# EAGLE design Módulo U.V. v.1.0 (EAGLE 9.4.2)
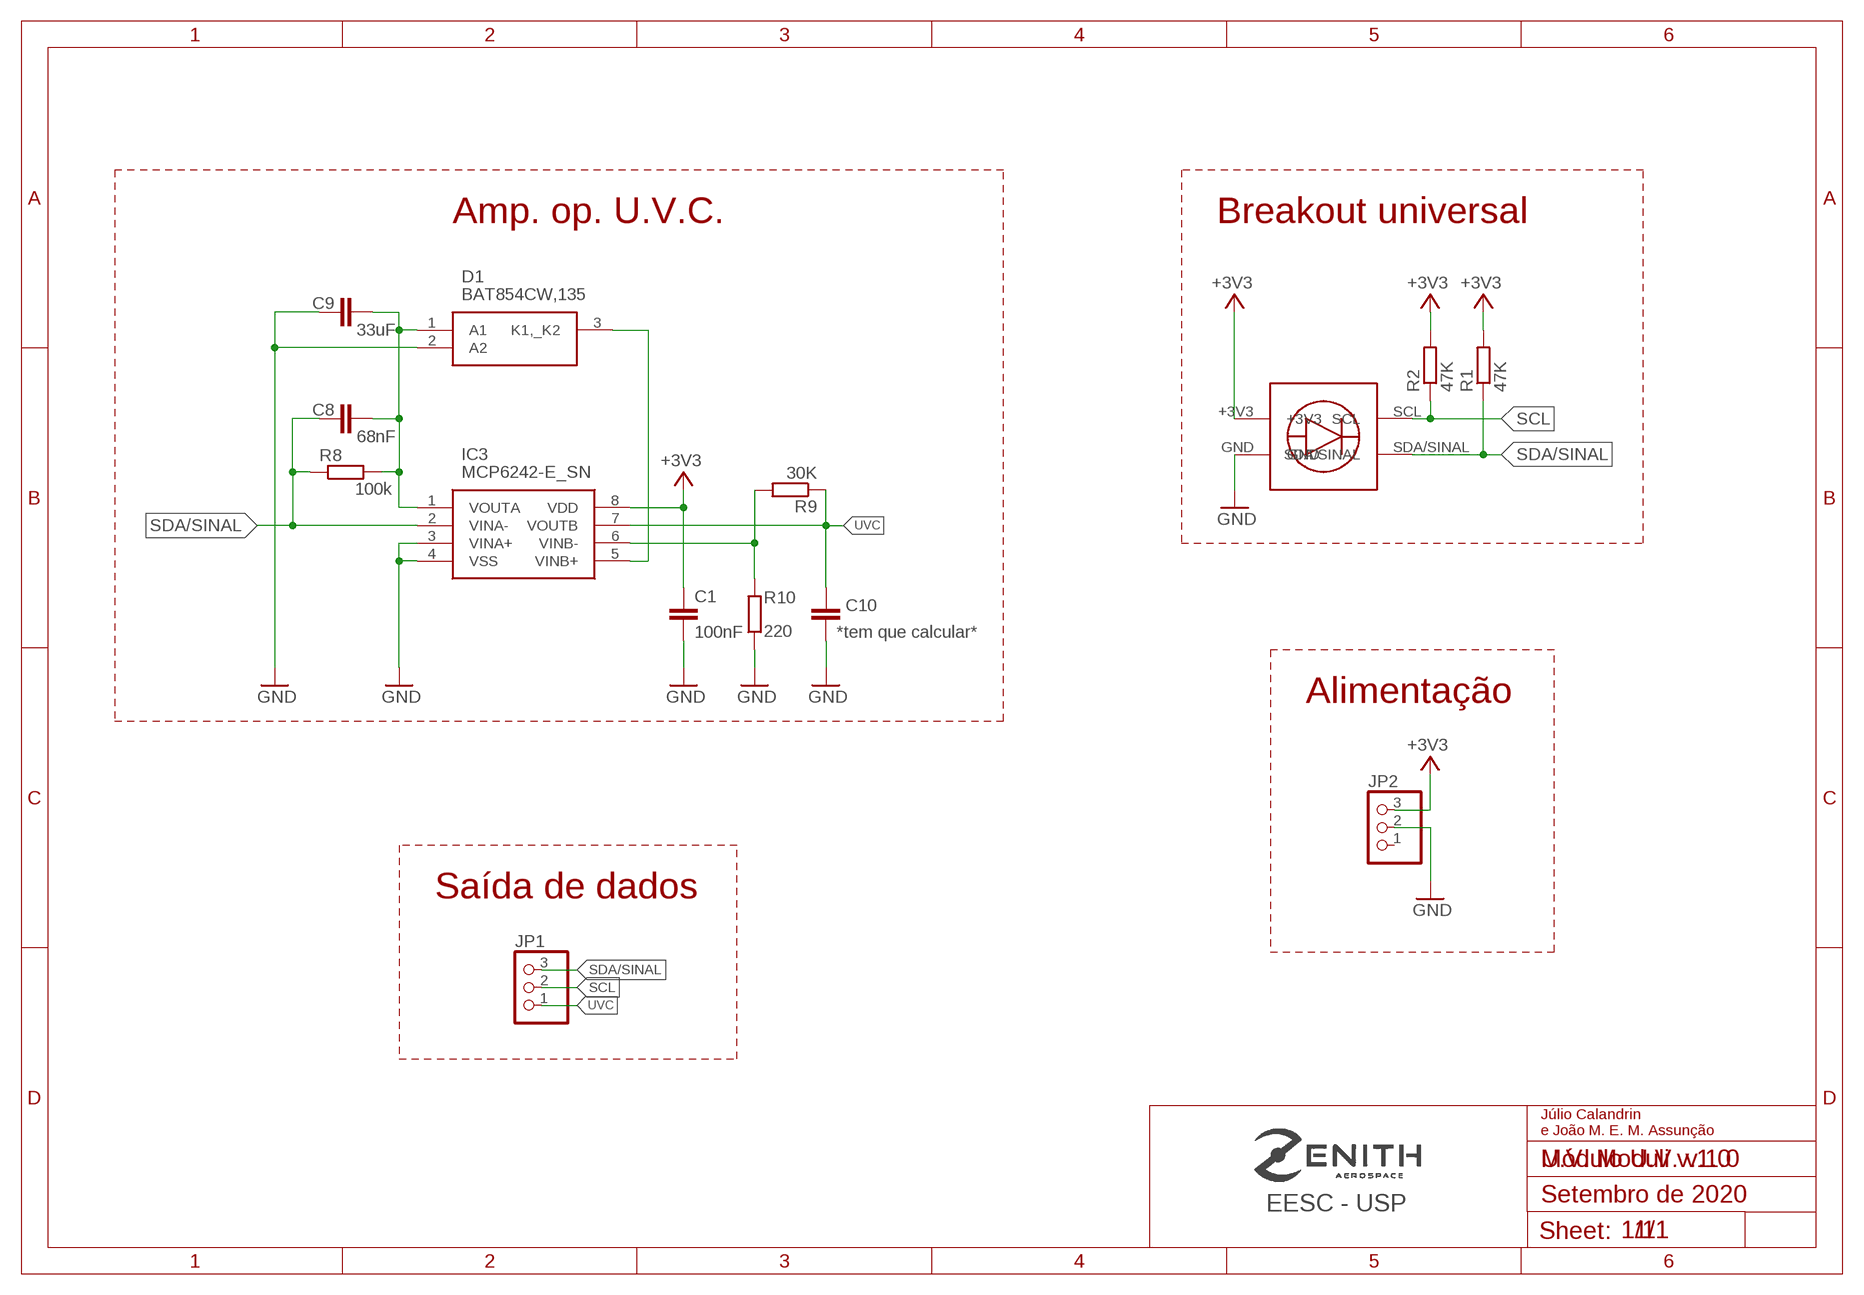
[diagram p0: schematic, sheet 1]

## Parts
C1  100nF  C-EUC0805  [C0805]
C8  68nF  C-EUC0805  [C0805]
C9  33uF  C-EUC0805  [C0805]
C10  *tem que calcular*  C-EUC0805  [C0805]
D1  BAT854CW,135  [SOT65P210X110-3N]
IC3  MCP6242-E_SN  [SOIC127P600X175-8N]
JP1  PINHD-1X3  [1X03]
JP2  PINHD-1X3  [1X03]
R1  47K  R-EU_R0805  [R0805]
R2  47K  R-EU_R0805  [R0805]
R8  100k  R-EU_R0805  [R0805]
R9  30K  R-EU_R0805  [R0805]
R10  220  R-EU_R0805  [R0805]
U$1  UNIVERSAL_BREAKOUT  [UNIVERSAL_PADS]

## Nets
+3V3: C1.1 IC3.8(VDD) JP2.3 R1.2 R2.2 U$1.+3V3
GND: C1.2 C9.2 C10.2 D1.2(A2) IC3.3(VINA+) IC3.4(VSS) JP2.2 R10.1 U$1.GND
N$1: C8.2 C9.1 D1.1(A1) IC3.1(VOUTA) R8.2
N$6: D1.3(K1,_K2) IC3.5(VINB+)
N$7: IC3.6(VINB-) R9.2 R10.2
SCL: JP1.2 R2.1 U$1.SCL
SDA/SINAL: C8.1 IC3.2(VINA-) JP1.3 R1.1 R8.1 U$1.SDA/SINAL
UVC: C10.1 IC3.7(VOUTB) JP1.1 R9.1
Unconnected: JP2.1

## Notes on the sheet
- Amp. op. U.V.C. | Breakout universal
- Alimentação
- Saída de dados
- Júlio Calandrin 
  e João M. E. M. Assunção
- U.V. Moduli v.1.0
- EESC - USP | Setembro de 2020
- 1/1

## Library data of the parts
C1 C8-C10 = rcl:C-EU: CAPACITOR, European symbol; SPICEPREFIX: C
D1 = SamacSys_Parts:BAT854CW,135: Schottky Diodes & Rectifiers Diode Schottky 40V 0.2A 3-Pin Source: Datasheet <https://componentsearchengine.com/Datasheets/1/BAT854CW,135.pdf>; DESCRIPTION: Schottky Diodes & Rectifiers Diode Schottky 40V 0.2A 3-Pin; HEIGHT: 1.1mm; MANUFACTURER_NAME: Nexperia; MANUFACTURER_PART_NUMBER: BAT854CW,135; MOUSER_PART_NUMBER: 771-BAT854CW,135; MOUSER_PRICE-STOCK: https://www.mouser.co.uk/ProductDetail/Nexperia/BAT854CW135?qs=qA5l9K33p8A9v2co28hhGg%3D%3D
IC3 = SamacSys_Parts:MCP6242-E_SN: Dual 1.8V,650kHz Op Amp,MCP6242-E/SN Source: Datasheet; DESCRIPTION: Dual 1.8V,650kHz Op Amp,MCP6242-E/SN; HEIGHT: 1.75mm; MANUFACTURER_NAME: Microchip; MANUFACTURER_PART_NUMBER: MCP6242-E/SN; MOUSER_PART_NUMBER: 579-MCP6242-E/SN; MOUSER_PRICE-STOCK: https://www.mouser.co.uk/ProductDetail/Microchip-Technology/MCP6242-E-SN?qs=huzeVNXgovWmReOh7v8Fuw%3D%3D
JP1 JP2 = pinhead(1x3):PINHD-1X3: PIN HEADER
R1 R2 R8-R10 = rcl:R-EU_: RESISTOR, European symbol; SPICEPREFIX: R
U$1 = Zenith_Breakouts:UNIVERSAL_BREAKOUT

## Board
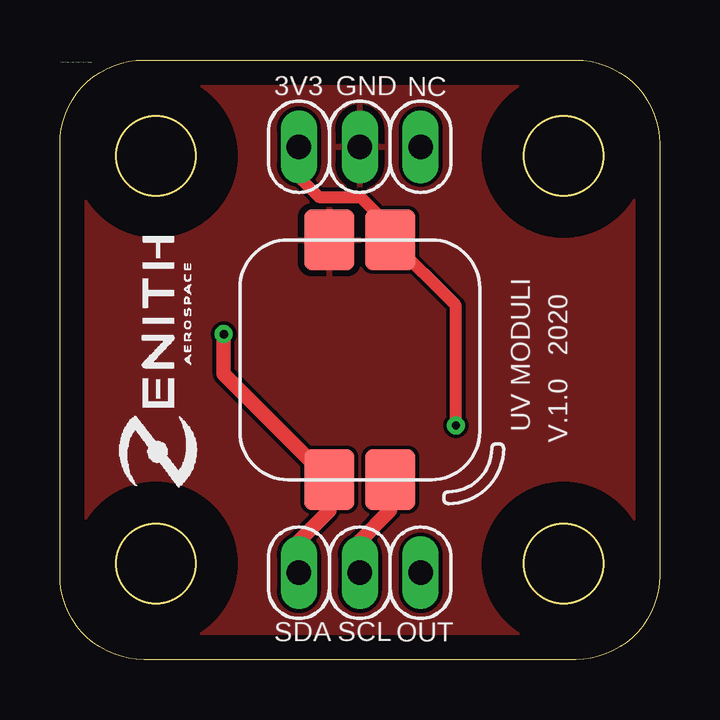
[diagram p1: board, top side]
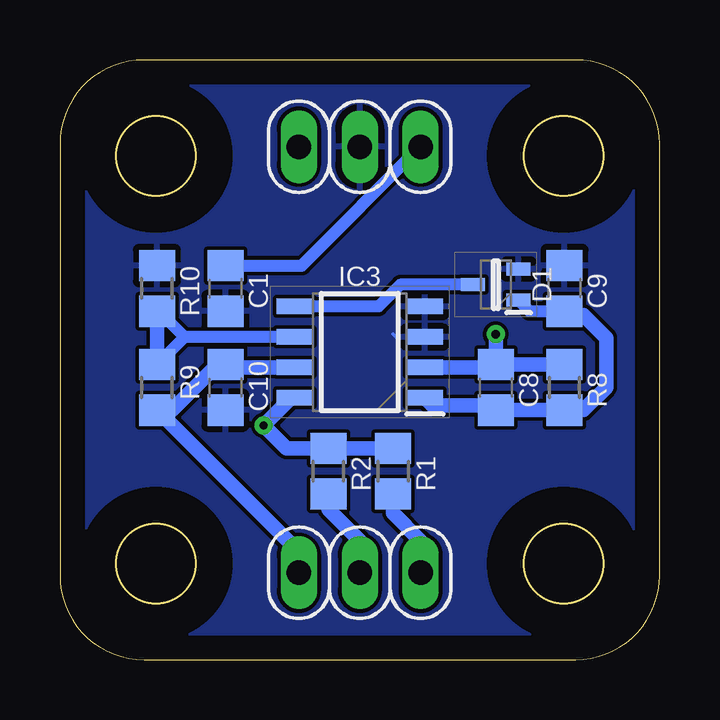
[diagram p2: board, bottom side, seen from below]

Size 25 x 25 mm. Coordinates in mm from the lower left corner, seen from the top.
Outline: 0,3.5 0,21.5 arc-90 3.5,25 21.5,25 arc-90 25,21.5 25,3.5 arc-90 21.5,0 3.5,0 arc-90 0,3.5
Outline: circle at 4,21 radius 1.65
Outline: circle at 21,21 radius 1.65
Outline: circle at 4,4 radius 1.65
Outline: circle at 21,4 radius 1.65
Copper layers (1*16): Top 0.035mm / dielectric 1.5mm / Bottom 0.035mm
Design rules "default": minimum track width 6mil, minimum drill 0.35mm, track to track 6mil, track to pad 6mil, pad to pad 6mil, via to via 6mil, smd to smd 6mil, copper to edge 40mil, drill to drill 6mil, minimum pad ring 10mil, minimum via ring 8mil, stop-mask expansion 4mil, vias tented up to drill 0mil, thermal gap 10mil
tRestrict: area 0.8,17.8 to 7.2,24.2; area 17.8,17.8 to 24.2,24.2; area 0.8,0.8 to 7.2,7.2; area 17.8,0.8 to 24.2,7.2
bRestrict: area 1,18 to 7,24; area 18,18 to 24,24; area 18,1 to 24,7; area 1,1 to 7,7

### Footprints (pad centres in the part's own frame; a part is rotated, then mirrored left to right if it is on the bottom)
C0805 = smd 1.3 x 1.5: 1 -0.95,0; 2 0.95,0
SOT65P210X110-3N = smd 1 x 0.55: 1 -0.95,0.65; 2 -0.95,-0.65; 3 0.95,0
SOIC127P600X175-8N = smd 1.528 x 0.65: 1 -2.711,1.905; 2 -2.711,0.635; 3 -2.711,-0.635; 4 -2.711,-1.905; 5 2.711,-1.905; 6 2.711,-0.635; 7 2.711,0.635; 8 2.711,1.905
1X03 = drill 1.016 long: 1 -2.54,0; 2 0,0; 3 2.54,0
R0805 = smd 1.3 x 1.5: 1 -0.95,0; 2 0.95,0
UNIVERSAL_PADS = smd 2.54 x 2.1: +3V3 -5,1.27; GND -5,-1.27; SCL 5,1.27; SDA/SINAL 5,-1.27

### Placement (x,y rotation side)
C1  18.1,15.47 270 bottom
C8  6.83,11.35 270 bottom
C9  3.97,15.47 90 bottom
C10  18.1,11.35 270 bottom
D1  6.83,15.63 180 bottom
IC3  12.5,12.82 180 bottom
JP1  12.5,3.62 180 top
JP2  12.5,21.38 180 top
R1  11.11,7.86 90 bottom
R2  13.81,7.86 90 bottom
R8  3.97,11.35 270 bottom
R9  20.95,11.35 90 bottom
R10  20.95,15.47 270 bottom
U$1  12.5,12.5 270 top

### Tracks (layer width: path | path; a pad name or v marks a point on that pad's centre or on a via)
+3V3  (via drill 0.35)
  Top 0.508: JP2.3 9.96,20.12 10.79,19.29 12.54,19.29 13.77,18.06 U$1.+3V3 16.51,14.76 v16.51,9.76
  Bottom 0.508: C1.1 14.91,16.43 JP2.3
  Bottom 0.61: IC3.8 15.36,10.91 v16.51,9.76 15.55,8.8 R2.2 R1.2
GND
  Bottom 0.152: 10.99,13.45 11.11,13.57
  pour Top: -3.04,28.04 25.5,28.04 25.5,-0.5 -3.04,-0.5
  pour Bottom: -1.45,26.14 25.5,26.14 25.5,-0.18 -1.45,-0.18
N$1
  Bottom 0.508: D1.1 5.42,14.53 C9.1 3.65,14.53 3.49,14.36 | 6.67,10.4 C8.2
  Bottom 0.61: 7.14,10.71 C8.2 7.02,10.6 9.47,10.6 IC3.1 | 6.67,10.4 R8.2 3.17,10.4 2.22,11.35 2.22,13.41 3.17,14.36 3.49,14.36
N$6
  Bottom 0.508: IC3.5 11.72,14.72 10.81,15.63 D1.3
N$7
  Bottom 0.508: IC3.6 19.8,13.45 | 20.59,14.25 19.8,13.45 | 19.8,13.45 R9.2
  Bottom 0.61: R9.2 R10.2 20.87,14.53 20.59,14.25
SCL
  Top 0.61: JP1.2 12.5,4.96 13.77,6.23 U$1.SCL
  Bottom 0.61: JP1.2 12.5,4.96 13.81,6.27 R2.1
SDA/SINAL  (via drill 0.35)
  Top 0.508: 6.83,11.98 v6.83,13.57
  Top 0.61: JP1.3 9.96,4.96 11.23,6.23 U$1.SDA/SINAL 7.18,11.55 6.83,11.9 v6.83,13.57
  Bottom 0.61: IC3.2 6.94,12.18 C8.1 | C8.1 R8.1 | JP1.3 9.96,4.96 11.11,6.11 R1.1 | v6.83,13.57 C8.1
UVC
  Bottom 0.508: 17.98,12.18 C10.1
  Bottom 0.61: IC3.7 17.98,12.18 | JP1.1 15.04,4.48 R9.1 | R9.1 20.48,10.39 | C10.1 18.42,12.3 20.32,10.4 R9.1

### Text on the board
tNames: C:/Users/marcu/Desktop/zenith-v05.bmp | 3V3 | GND | NC | UV MODULI | V.1.0 2020 | SDA | SCL | OUT